# EAGLE design ups_main (EAGLE 9.6.2)
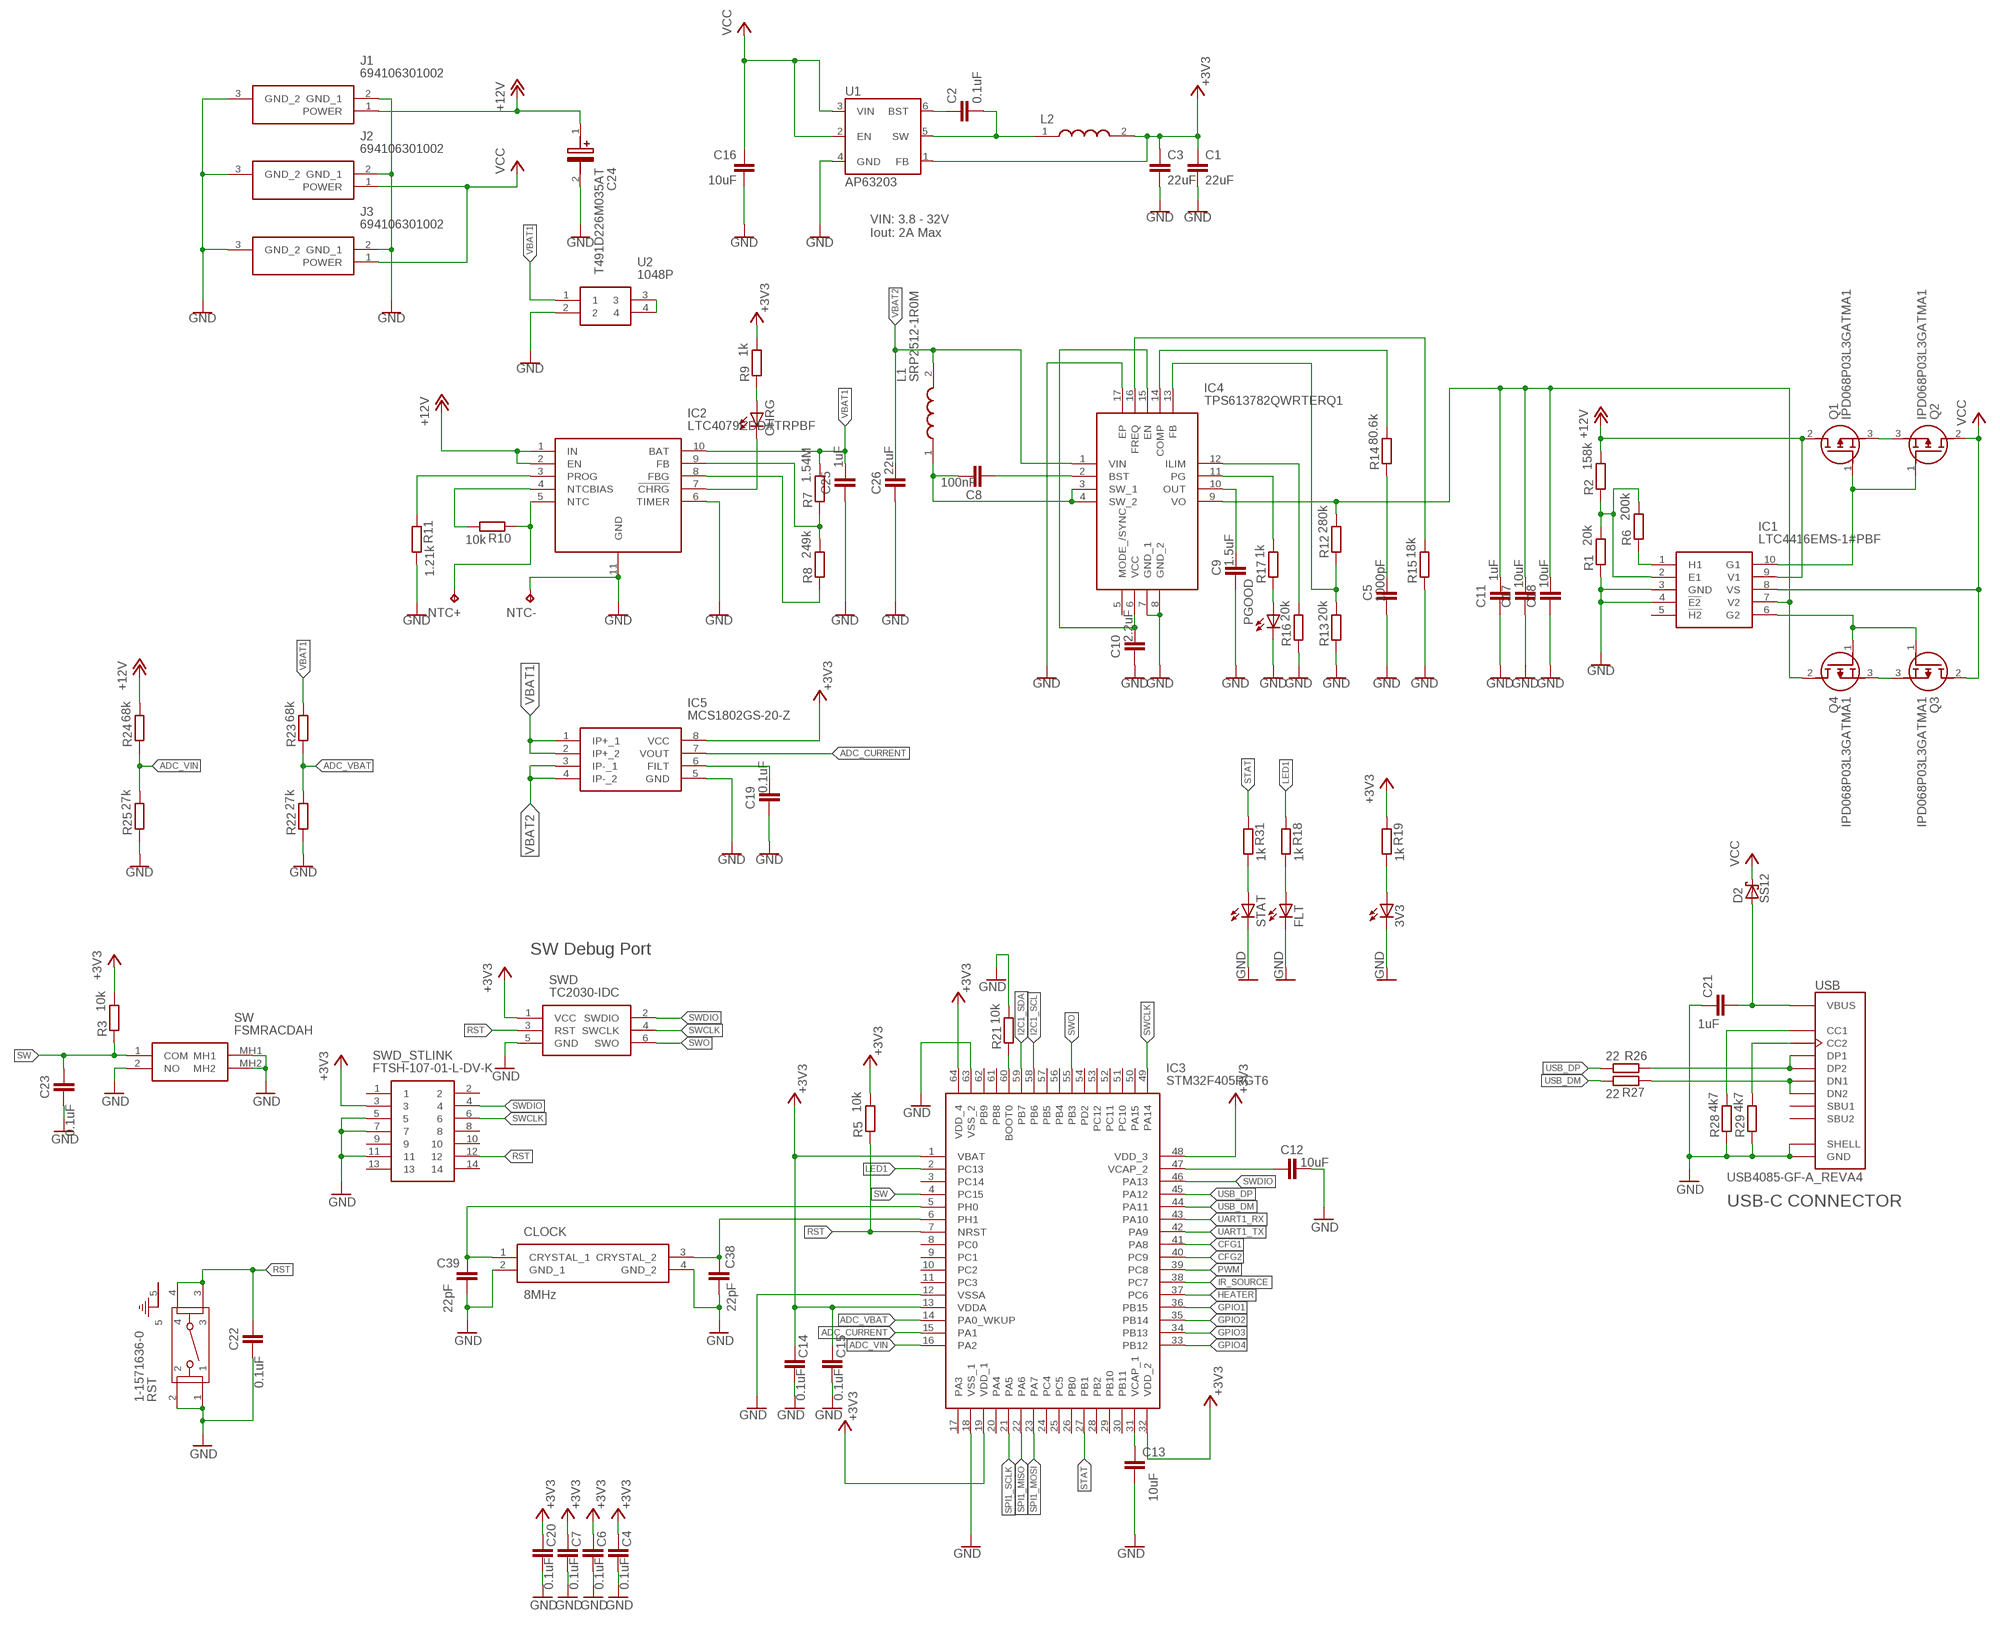
[diagram p0: schematic, sheet 1]

## Parts
3V3  LEDCHIPLED_0805  [CHIPLED_0805]
C1  22uF  22UF-0603-6.3V-20%  [0603]
C2  0.1uF  0.1UF-0603-25V-5%  [0603]
C3  22uF  22UF-0603-6.3V-20%  [0603]
C4  0.1uF  C-EUC0603K  [C0603K]
C5  1000pF  C-EUC0603K  [C0603K]
C6  0.1uF  C-EUC0603K  [C0603K]
C7  0.1uF  C-EUC0603K  [C0603K]
C8  100nF  C-EUC0603K  [C0603K]
C9  1.5uF  C-EUC0603K  [C0603K]
C10  2.2uF  C-EUC0603K  [C0603K]
C11  1uF  C-EUC0603K  [C0603K]
C12  10uF  C-EUC0603K  [C0603K]
C13  10uF  C-EUC0603K  [C0603K]
C14  0.1uF  C-EUC0603K  [C0603K]
C15  0.1uF  C-EUC0603K  [C0603K]
C16  10uF  10UF-1210-50V-20%  [1210]
C17  10uF  C-EUC0603K  [C0603K]
C18  10uF  C-EUC0603K  [C0603K]
C19  0.1uF  C-EUC0603K  [C0603K]
C20  0.1uF  C-EUC0603K  [C0603K]
C21  1uF  C-EUC0603K  [C0603K]
C22  0.1uF  C-EUC0603K  [C0603K]
C23  0.1uF  C-EUC0603K  [C0603K]
C24  T491D226M035AT  [T491D]
C25  1uF  C-EUC0603K  [C0603K]
C26  22uF  C-EUC0603K  [C0603K]
C38  22pF  C-EUC0603K  [C0603K]
C39  22pF  C-EUC0603K  [C0603K]
CHRG  LEDCHIPLED_0805  [CHIPLED_0805]
CLOCK  8MHz  ABM8AIG-8.000MHZ-1Z-T  [ABM8AIG8000MHZ1ZT]
D2  SS12  [DO214AC]
FLT  LEDCHIPLED_0805  [CHIPLED_0805]
IC1  LTC4416EMS-1#PBF  [SOP50P490X110-10N]
IC2  LTC4079EDD#TRPBF  [SON50P300X300X80-11N]
IC3  STM32F405RGT6  [QFP50P1200X1200X160-64N]
IC4  TPS613782QWRTERQ1  TPS613783QWRTERQ1  [QFN50P300X300X80-17N]
IC5  MCS1802GS-20-Z  [SOIC127P600X175-8N]
J1  694106301002  [694106301002_1]
J2  694106301002  [694106301002_1]
J3  694106301002  [694106301002_1]
L1  SRP2512-1R0M  [INDC2520X120N]
L2  MLZ2012M4R7HT000  [INDC2012X145N]
NTC+  TPPAD1-17  [P1-17]
NTC-  TPPAD1-17  [P1-17]
PGOOD  LEDCHIPLED_0805  [CHIPLED_0805]
Q1  IPD068P03L3GATMA1  [IPD068P03L3GATMA1]
Q2  IPD068P03L3GATMA1  [IPD068P03L3GATMA1]
Q3  IPD068P03L3GATMA1  [IPD068P03L3GATMA1]
Q4  IPD068P03L3GATMA1  [IPD068P03L3GATMA1]
R1  20k  R-EU_R0603  [R0603]
R2  158k  R-EU_R0603  [R0603]
R3  10k  R-EU_R0603  [R0603]
R5  10k  R-EU_R0603  [R0603]
R6  200k  R-EU_R0603  [R0603]
R7  1.54M  R-EU_R0603  [R0603]
R8  249k  R-EU_R0603  [R0603]
R9  1k  R-EU_R0603  [R0603]
R10  10k  R-EU_R0603  [R0603]
R11  1.21k  R-EU_R0603  [R0603]
R12  280k  R-EU_R0603  [R0603]
R13  20k  R-EU_R0603  [R0603]
R14  80.6k  R-EU_R0603  [R0603]
R15  18k  R-EU_R0603  [R0603]
R16  20k  R-EU_R0603  [R0603]
R17  1k  R-EU_R0603  [R0603]
R18  1k  R-EU_R0603  [R0603]
R19  1k  R-EU_R0603  [R0603]
R21  10k  R-EU_R0603  [R0603]
R22  27k  R-EU_R0603  [R0603]
R23  68k  R-EU_R0603  [R0603]
R24  68k  R-EU_R0603  [R0603]
R25  27k  R-EU_R0603  [R0603]
R26  22  R-EU_R0603  [R0603]
R27  22  R-EU_R0603  [R0603]
R28  4k7  R-EU_R0603  [R0603]
R29  4k7  R-EU_R0603  [R0603]
R31  1k  R-EU_R0603  [R0603]
RST  1-1571636-0  [SW5_1571636]
STAT  LEDCHIPLED_0805  [CHIPLED_0805]
SW  FSMRACDAH  [FSMRACDAH]
SWD  TC2030-IDC  [TC2030IDC]
SWD_STLINK  FTSH-107-01-L-DV-K  [FTSH-107-XX-YYY-DV-K]
U1  AP63203  [SOT23-6]
U2  1048P  [1048P]
USB  USB4085-GF-A_REVA4  [GCT_USB4085-GF-A_REVA4]

## Nets
+3V3: C1.1 C3.1 C4.1 C6.1 C7.1 C14.1 C15.1 C20.1 IC3.1(VBAT) IC3.13(VDDA) IC3.19(VDD_1) IC3.32(VDD_2) IC3.48(VDD_3) IC3.64(VDD_4) IC5.8(VCC) L2.2 R3.2 R5.2 R9.2 R19.1 SWD.1(VCC) SWD_STLINK.3 U1.1(FB)
+12V: C24.1(+) IC1.9(V1) IC2.1(IN) IC2.2(EN) J1.1(POWER) Q1.2(D) R2.2 R24.2
ADC_CURRENT: IC3.15(PA1) IC5.7(VOUT)
ADC_VBAT: IC3.14(PA0_WKUP) R22.2 R23.1
ADC_VIN: IC3.16(PA2) R24.1 R25.2
CFG1: IC3.41(PA8)
CFG2: IC3.40(PC9)
GND: 3V3.C C1.2 C3.2 C4.2 C5.1 C6.2 C7.2 C9.1 C10.1 C11.1 C12.2 C13.2 C14.2 C15.2 C16.2 C17.1 C18.1 C19.1 C20.2 C21.1 C22.2 C23.2 C24.2(-) C25.1 C26.1 C38.2 C39.2 CLOCK.2(GND_1) CLOCK.4(GND_2) FLT.C IC1.3(GND) IC1.4(!E2) IC2.6(TIMER) IC2.11(GND) IC3.12(VSSA) IC3.18(VSS_1) IC3.63(VSS_2) IC4.7(GND_1) IC4.8(GND_2) IC4.17(EP) IC5.5(GND) J1.2(GND_1) J1.3(GND_2) J2.2(GND_1) J2.3(GND_2) J3.2(GND_1) J3.3(GND_2) NTC-.TP PGOOD.C R1.1 R11.2 R13.1 R15.1 R16.1 R21.2 R22.1 R25.1 R28.1 R29.1 RST.1 RST.2 STAT.C SW.2(NO) SW.MH1 SW.MH2 SWD.5(GND) SWD_STLINK.5 SWD_STLINK.7 SWD_STLINK.11 U1.4(GND) U2.2 USB.A1(GND) USB.A12(GND) USB.B1(GND) USB.B12(GND) USB.P1(SHELL) USB.P2(SHELL) USB.P3(SHELL) USB.P4(SHELL)
GPIO1: IC3.36(PB15)
GPIO2: IC3.35(PB14)
GPIO3: IC3.34(PB13)
GPIO4: IC3.33(PB12)
HEATER: IC3.37(PC6)
I2C1_SCL: IC3.58(PB6)
I2C1_SDA: IC3.59(PB7)
IR_SOURCE: IC3.38(PC7)
LED1: IC3.2(PC13) R18.1
N$1: C2.1 U1.6(BST)
N$2: Q3.3(S) Q4.3(S)
N$3: IC1.6(G2) Q3.1(G) Q4.1(G)
N$4: FLT.A R18.2
N$5: IC1.10(G1) Q1.1(G) Q2.1(G)
N$6: C12.1 IC3.47(VCAP_2)
N$7: IC1.1(H1) R6.1
N$8: IC1.2(E1) R1.2 R2.1 R6.2
N$9: C2.2 L2.1 U1.5(SW)
N$10: Q1.3(S) Q2.3(S)
N$11: IC4.12(ILIM) R16.2
N$12: C13.1 IC3.31(VCAP_1)
N$13: IC4.11(PG) R17.2
N$14: IC2.4(NTCBIAS) R10.2
N$15: IC2.5(NTC) NTC+.TP R10.1
N$16: IC2.3(PROG) R11.1
N$17: IC2.9(FB) R7.1 R8.2
N$18: IC2.8(FBG) R8.1
N$19: CHRG.C IC2.7(!CHRG)
N$20: C38.1 CLOCK.3(CRYSTAL_2) IC3.6(PH1)
N$21: C9.2 IC4.10(OUT)
N$22: IC4.16(FREQ) R15.2
N$23: IC4.14(COMP) R14.2
N$24: C8.1 IC4.2(BST)
N$25: C8.2 IC4.3(SW_1) IC4.4(SW_2) L1.1
N$26: C39.1 CLOCK.1(CRYSTAL_1) IC3.5(PH0)
N$27: C5.2 R14.1
N$28: IC4.13(FB) R12.1 R13.2
N$30: 3V3.A R19.2
N$31: R31.2 STAT.A
N$32: C21.2 D2.A USB.A4(VBUS) USB.A9(VBUS) USB.B4(VBUS) USB.B9(VBUS)
N$33: PGOOD.A R17.1
N$34: CHRG.A R9.1
N$35: IC3.60(BOOT0) R21.1
N$36: R26.1 USB.A6(DP1) USB.B6(DP2)
N$37: C10.2 IC4.6(VCC) IC4.15(EN)
N$38: R27.1 USB.A7(DN1) USB.B7(DN2)
N$40: C19.2 IC5.6(FILT)
N$41: U2.3 U2.4
N$46: R29.2 USB.B5(CC2)
N$47: R28.2 USB.A5(CC1)
PWM: IC3.39(PC8)
RST: C22.1 IC3.7(NRST) R5.1 RST.3 RST.4 SWD.3(RST) SWD_STLINK.12
SPI1_MISO: IC3.22(PA6)
SPI1_MOSI: IC3.23(PA7)
SPI1_SCLK: IC3.21(PA5)
STAT: IC3.27(PB1) R31.1
SW: C23.1 IC3.4(PC15) R3.1 SW.1(COM)
SWCLK: IC3.49(PA14) SWD.4(SWCLK) SWD_STLINK.6
SWDIO: IC3.46(PA13) SWD.2(SWDIO) SWD_STLINK.4
SWO: IC3.55(PB3) SWD.6(SWO)
UART1_RX: IC3.43(PA10)
UART1_TX: IC3.42(PA9)
USB_DM: IC3.44(PA11) R27.2
USB_DP: IC3.45(PA12) R26.2
VBAT1: C25.2 IC2.10(BAT) IC5.1(IP+_1) IC5.2(IP+_2) R7.2 R23.2 U2.1
VBAT2: C26.2 IC4.1(VIN) IC5.3(IP-_1) IC5.4(IP-_2) L1.2
VCC: C16.1 D2.C IC1.8(VS) J2.1(POWER) J3.1(POWER) Q2.2(D) Q3.2(D) U1.2(EN) U1.3(VIN)
VO: C11.2 C17.2 C18.2 IC1.7(V2) IC4.9(VO) Q4.2(D) R12.2
Unconnected: IC1.5(!H2) IC3.3(PC14) IC3.8(PC0) IC3.9(PC1) IC3.10(PC2) IC3.11(PC3) IC3.17(PA3) IC3.20(PA4) IC3.24(PC4) IC3.25(PC5) IC3.26(PB0) IC3.28(PB2) IC3.29(PB10) IC3.30(PB11) IC3.50(PA15) IC3.51(PC10) IC3.52(PC11) IC3.53(PC12) IC3.54(PD2) IC3.56(PB4) IC3.57(PB5) IC3.61(PB8) IC3.62(PB9) IC4.5(MODE_/SYNC) RST.5 SWD_STLINK.1 SWD_STLINK.2 SWD_STLINK.8 SWD_STLINK.9 SWD_STLINK.10 SWD_STLINK.13 SWD_STLINK.14 USB.A8(SBU1) USB.B8(SBU2)

## Notes on the sheet
- VIN: 3.8 - 32V
  Iout: 2A Max
- SW Debug Port
- USB-C CONNECTOR

## Library data of the parts
3V3 CHRG FLT PGOOD STAT = led:LED: LED OSRAM: - CHIPLED LG R971, LG N971, LY N971, LG Q971, LY Q971, LO R971, LY R971 LH N974, LH R974 LS Q976, LO Q976, LY Q976 LO Q996 - Hyper CHIPLED LW Q18S LB Q993, LB Q99A, LB R99A - SideLED LS A670, LO A670, LY A670, LG A670, LP A670 LB A673, LV A673, LT A673, LW A673 LH A674 LY A675 LS A676, LA A676, LO A676, LY A676, LW A676 LS A679, LY A679, LG A679 - Hyper Micro SIDELED® LS Y876, LA Y876, LO Y876, LY Y876 LT Y87S - SmartLED LW L88C, LW L88S LB L89C, LB L89S, LG L890 LS L89K, LO L89K, LY L89K LS L896, LA L896, LO L896, LY L896 - TOPLED LS T670, LO T670, LY T670, LG T670, LP T670 LSG T670, LSP T670, LSY T670, LOP T670, LYG T670 LG T671, LOG T671, LSG T671 LB T673, LV T673, LT T673, LW T673 LH T674 LS T676, LA T676, LO T676, LY T676, LB T676, LH T676, LSB T676, LW T676 LB T67C, LV T67C, LT T67C, LS T67K, LO T67K, LY T67K, LW E67C LS E67B, LA E67B, LO E67B, LY E67B, LB E67C, LV E67C, LT E67C LW T67C LS T679, LY T679, LG T679 LS T770, LO T770, LY T770, LG T770, LP T770 LB T773, LV T773, LT T773, LW T773 LH T774 LS E675, LA E675, LY E675, LS T675 LS T776, LA T776, LO T776, LY T776, LB T776 LHGB T686 LT T68C, LB T68C - Hyper Mini TOPLED® LB M676 - Mini TOPLED Santana® LG M470 LS M47K, LO M47K, LY M47K Source: http://www.osram.convergy.de LUXEON: - LUMILED® LXK2-PW12-R00, LXK2-PW12-S00, LXK2-PW14-U00, LXK2-PW14-V00 LXK2-PM12-R00, LXK2-PM12-S00, LXK2-PM14-U00 LXK2-PE12-Q00, LXK2-PE12-R00, LXK2-PE12-S00, LXK2-PE14-T00, LXK2-PE14-U00 LXK2-PB12-K00, LXK2-PB12-L00, LXK2-PB12-M00, LXK2-PB14-N00, LXK2-PB14-P00, LXK2-PB14-Q00 LXK2-PR12-L00, LXK2-PR12-M00, LXK2-PR14-Q00, LXK2-PR14-R00 LXK2-PD12-Q00, LXK2-PD12-R00, LXK2-PD12-S00 LXK2-PH12-R00, LXK2-PH12-S00 LXK2-PL12-P00, LXK2-PL12-Q00, LXK2-PL12-R00 Source: www.luxeon.com KINGBRIGHT: KA-3528ASYC Source: www.kingbright.com
C1 C3 = SparkFun-Capacitors:22UF: 22µF ceramic capacitors A capacitor is a passive two-terminal electrical component used to store electrical energy temporarily in an electric field.; PROD_ID: CAP-14464
C2 = SparkFun-Capacitors:0.1UF: 0.1µF ceramic capacitors A capacitor is a passive two-terminal electrical component used to store electrical energy temporarily in an electric field.; PROD_ID: CAP-08604
C4-C15 C17-C23 C25 C26 C38 C39 = rcl:C-EU: CAPACITOR, European symbol; SPICEPREFIX: C
C16 = SparkFun-Capacitors:10UF: 10.0µF ceramic capacitors A capacitor is a passive two-terminal electrical component used to store electrical energy temporarily in an electric field.; PROD_ID: CAP-09824
C24 = T491D226M035AT:T491D226M035AT: T491, Tantalum, MnO2 Tantalum, Commercial Grade, 22 uF, 20%, 35 VDC, 125C, -55C, 85C, SMD, MnO2, Molded, 6 % , 700 mOhms, 7700 nA, 446.84 mg, 7343, 2.8mm, Height Max = 3.1mm, 500, 156 Weeks Source: Datasheet <https://content.kemet.com/datasheets/KEM_T2005_T491.pdf>; DESCRIPTION: T491, Tantalum, MnO2 Tantalum, Commercial Grade, 22 uF, 20%, 35 VDC, 125C, -55C, 85C, SMD, MnO2, Molded, 6 % , 700 mOhms, 7700 nA, 446.84 mg, 7343, 2.8mm, Height Max = 3.1mm, 500, 156 Weeks; HEIGHT: 3.1mm; MANUFACTURER_NAME: KEMET; MANUFACTURER_PART_NUMBER: T491D226M035AT; MOUSER_PART_NUMBER: 80-T491D226M035; MOUSER_PRICE-STOCK: https://www.mouser.co.uk/ProductDetail/KEMET/T491D226M035AT?qs=2Dzs5xnho3a9L55s8fyD1A%3D%3D
CLOCK = ABM8AIG-8.000MHZ-1Z-T:ABM8AIG-8.000MHZ-1Z-T: Crystals 18pF 8MHz 10ppm AEC-Q200 -40C +125C Source: Datasheet <https://abracon.com/AIGcrystals/ABM8AIG.pdf>; DESCRIPTION: Crystals 18pF 8MHz 10ppm AEC-Q200 -40C +125C; HEIGHT: 0.8mm; MANUFACTURER_NAME: ABRACON; MANUFACTURER_PART_NUMBER: ABM8AIG-8.000MHZ-1Z-T; MOUSER_PART_NUMBER: 815-M8AIG-8-1ZT; MOUSER_PRICE-STOCK: https://www.mouser.com/Search/Refine.aspx?Keyword=815-M8AIG-8-1ZT
D2 = SS12:SS12: http://octopart.com/ss12-tp-mcc-9293796; AVAILABILITY: Unavailable; DESCRIPTION: SS12 Series 500 mV 1 A 20 V Max Reverse Voltage Schottky Rectifier - DO-214AC; MF: Klein Tools,; MP: SS12; PACKAGE: DO-214AC-214 ON Semiconductor; PRICE: None
IC1 = LTC4416EMS-1#PBF:LTC4416EMS-1#PBF: Linear Technology LTC4416EMS-1#PBF, MOSFET Controller 10-Pin, MSOP Source: Datasheet <https://www.analog.com/media/en/technical-documentation/data-sheets/4416fa.pdf>; DESCRIPTION: Linear Technology LTC4416EMS-1#PBF, MOSFET Controller 10-Pin, MSOP; HEIGHT: 1.1mm; MANUFACTURER_NAME: Analog Devices; MANUFACTURER_PART_NUMBER: LTC4416EMS-1#PBF; MOUSER_PART_NUMBER: 584-LTC4416EMS-1#PBF; MOUSER_PRICE-STOCK: https://www.mouser.co.uk/ProductDetail/Analog-Devices/LTC4416EMS-1PBF?qs=hVkxg5c3xu9mDay6QbsUoQ%3D%3D
IC2 = LTC4079EDD#TRPBF:LTC4079EDD#TRPBF: Battery Management Low Iq 60V, 250mA Linear Charger Source: Datasheet <http://www.linear.com/docs/45554>; DESCRIPTION: Battery Management Low Iq 60V, 250mA Linear Charger; HEIGHT: 0.8mm; MANUFACTURER_NAME: Analog Devices; MANUFACTURER_PART_NUMBER: LTC4079EDD#TRPBF; MOUSER_PART_NUMBER: 584-LTC4079EDD#TRPBF; MOUSER_PRICE-STOCK: https://www.mouser.co.uk/ProductDetail/Analog-Devices/LTC4079EDDTRPBF?qs=hVkxg5c3xu9bytIIUSwPNA%3D%3D
IC3 = STM32F405RGT6:STM32F405RGT6: MCU 32-Bit, ARM Cortex M4, 1MB Flash STMicroelectronics STM32F405RGT6, 32bit ARM Cortex M4F Microcontroller, 168MHz, 1024 kB Flash, 64-Pin LQFP Source: Datasheet <http://www.st.com/web/en/resource/technical/document/datasheet/DM00037051.pdf>; DESCRIPTION: MCU 32-Bit, ARM Cortex M4, 1MB Flash STMicroelectronics STM32F405RGT6, 32bit ARM Cortex M4F Microcontroller, 168MHz, 1024 kB Flash, 64-Pin LQFP; HEIGHT: 1.6mm; MANUFACTURER_NAME: STMicroelectronics; MANUFACTURER_PART_NUMBER: STM32F405RGT6; MOUSER_PART_NUMBER: 511-STM32F405RGT6; MOUSER_PRICE-STOCK: https://www.mouser.co.uk/ProductDetail/STMicroelectronics/STM32F405RGT6?qs=Z8%252BeY1k3TIKgj7QWsYGpQw%3D%3D
IC4 = TPS613783QWRTERQ1:TPS613783QWRTERQ1: Switching Voltage Regulators 18.5-V output, 4.8-A synchronous boost converter with load disconnect 16-WQFN -40 to 125 Source: Datasheet <https://www.ti.com/lit/ds/symlink/tps61378-q1.pdf?ts=1623306788513&ref_url=https%3A%2F%2Fwww.ti.com%2Fstore%2Fti%2Fen%2Fp%2Fproduct%2F%3Fp%3DTPS613785QWRTERQ1>; DESCRIPTION: Switching Voltage Regulators 18.5-V output, 4.8-A synchronous boost converter with load disconnect 16-WQFN -40 to 125; HEIGHT: 0.8mm; MANUFACTURER_NAME: Texas Instruments; MANUFACTURER_PART_NUMBER: TPS613783QWRTERQ1; MOUSER_PART_NUMBER: 595-PS613783QWRTERQ1; MOUSER_PRICE-STOCK: https://www.mouser.co.uk/ProductDetail/Texas-Instruments/TPS613783QWRTERQ1?qs=DRkmTr78QAS2n8buuGBazA%3D%3D
IC5 = MCS1802GS-20-Z:MCS1802GS-20-Z: Board Mount Current Sensors 3.3V Hall current sensor. 1.5% accuracy. 2.4kV Isolation Source: Datasheet <https://www.monolithicpower.com/en/documentview/productdocument/index/version/2/document_type/Datasheet/lang/en/sku/MCS1802/document_id/5066/>; DESCRIPTION: Board Mount Current Sensors 3.3V Hall current sensor. 1.5% accuracy. 2.4kV Isolation; HEIGHT: 1.75mm; MANUFACTURER_NAME: Monolithic Power Systems (MPS); MANUFACTURER_PART_NUMBER: MCS1802GS-20-Z; MOUSER_PART_NUMBER: 946-MCS1802GS-20-Z; MOUSER_PRICE-STOCK: https://www.mouser.co.uk/ProductDetail/Monolithic-Power-Systems-MPS/MCS1802GS-20-Z?qs=GedFDFLaBXEbUAyCuVB7cw%3D%3D
J1-J3 = 694106301002:694106301002: WURTH ELEKTRONIK - 694106301002 - CONNECTOR, POWER ENTRY, JACK, 3A, 20VDC Source: Datasheet <https://datasheet.datasheetarchive.com/originals/distributors/Datasheets_SAMA/1c153bd2ba42bb51bda59ee4cd9765cd.pdf>; DESCRIPTION: WURTH ELEKTRONIK - 694106301002 - CONNECTOR, POWER ENTRY, JACK, 3A, 20VDC; HEIGHT: mm; MANUFACTURER_NAME: Wurth Elektronik; MANUFACTURER_PART_NUMBER: 694106301002; MOUSER_PART_NUMBER: 710-694106301002; MOUSER_PRICE-STOCK: https://www.mouser.co.uk/ProductDetail/Wurth-Elektronik/694106301002?qs=a9WhcLg8qCwOEkcI62k5mA%3D%3D
L1 = SRP2512-1R0M:SRP2512-1R0M: BOURNS - SRP2512-1R0M - INDUCTOR, WIREWOUND, 1UH, 20%, 3.1A Source: Datasheet <https://componentsearchengine.com/Datasheets/2/SRP2512-1R0M.pdf>; DESCRIPTION: BOURNS - SRP2512-1R0M - INDUCTOR, WIREWOUND, 1UH, 20%, 3.1A; HEIGHT: 1.2mm; MANUFACTURER_NAME: Bourns; MANUFACTURER_PART_NUMBER: SRP2512-1R0M; MOUSER_PART_NUMBER: 652-SRP2512-1R0M; MOUSER_PRICE-STOCK: https://www.mouser.co.uk/ProductDetail/Bourns/SRP2512-1R0M?qs=fHAk5VQYflc1VrtfzBcSKQ%3D%3D
L2 = MLZ2012M4R7HT000:MLZ2012M4R7HT000: Inductor Power Shielded Multi-Layer 4.7uH 20% 2MHz Ferrite 0.4A 0.442Ohm DCR 0805 T/R Source: Datasheet <https://product.tdk.com/system/files/dam/doc/product/inductor/inductor/smd/catalog/inductor_commercial_decoupling_mlz2012_en.pdf>; DESCRIPTION: Inductor Power Shielded Multi-Layer 4.7uH 20% 2MHz Ferrite 0.4A 0.442Ohm DCR 0805 T/R; HEIGHT: 1.45mm; MANUFACTURER_NAME: TDK-Lambda; MANUFACTURER_PART_NUMBER: MLZ2012M4R7HT000; MOUSER_PART_NUMBER: 810-MLZ2012M4R7HT000; MOUSER_PRICE-STOCK: https://www.mouser.co.uk/ProductDetail/TDK/MLZ2012M4R7HT000?qs=%2FPzWLGNeQ%252BgQgMrI9kQ17A%3D%3D
NTC+ NTC- = testpad:TP: Test pad
Q1-Q4 = IPD068P03L3GATMA1:IPD068P03L3GATMA1: MOSFET TRENCH <= 40V Source: Datasheet <https://componentsearchengine.com/Datasheets/1/IPD068P03L3GATMA1.pdf>; DESCRIPTION: MOSFET TRENCH <= 40V; HEIGHT: 2.41mm; MANUFACTURER_NAME: Infineon; MANUFACTURER_PART_NUMBER: IPD068P03L3GATMA1; MOUSER_PART_NUMBER: 726-IPD068P03L3GATMA; MOUSER_PRICE-STOCK: https://www.mouser.co.uk/ProductDetail/Infineon-Technologies/IPD068P03L3GATMA1?qs=RJIhqtkBntMB6UQHOyDZmg%3D%3D
R1-R3 R5-R19 R21-R29 R31 = rcl:R-EU_: RESISTOR, European symbol; SPICEPREFIX: R
RST = TACTILE:1-1571636-0; BUILT_BY: EMA_UL_Team; CONFIGURATION__POLE-THROW_: Single Pole - Single Throw; COPYRIGHT: Copyright (C) 2016 Accelerated Designs. All rights reserved; DESCRIPTION: TACT,SMT,GULL WING,260GF,T&R; MANUFACTURER_PART_NUMBER: 1-1571636-0; MAX_SWITCHING_CURRENT: -; MAX_SWITCHING_VOLTAGE_AC_: -; PRODUCT_TYPE: Switch; SWITCH_TYPE: Tactile Switches; TE_PART_NUMBER: 1-1571636-0; VENDOR: TE Connectivity
SW = FSMRACDAH:FSMRACDAH: TE CONNECTIVITY / ALCOSWITCH - FSMRACDAH - TACTILE SWITCH, SPST-NO, 0.05A, 24V, TH Source: Datasheet <https://www.te.com/commerce/DocumentDelivery/DDEController?Action=showdoc&DocId=Customer Drawing1825968B1pdfEnglishENG_CD_1825968_B1.pdf1825968-2>; DESCRIPTION: TE CONNECTIVITY / ALCOSWITCH - FSMRACDAH - TACTILE SWITCH, SPST-NO, 0.05A, 24V, TH; HEIGHT: 9.2mm; MANUFACTURER_NAME: TE Connectivity; MANUFACTURER_PART_NUMBER: FSMRACDAH; MOUSER_PART_NUMBER: 506-FSMRACDAH; MOUSER_PRICE-STOCK: https://www.mouser.co.uk/ProductDetail/TE-Connectivity-Alcoswitch/FSMRACDAH?qs=GXuM9q1TrDlqFSLkwG2zzQ%3D%3D
SWD = TC2030-IDC:TC2030-IDC: CABLE ADAPTER 6 POS Source: Datasheet <http://www.tag-connect.com/Materials/TC2030-IDC.pdf>; DESCRIPTION: CABLE ADAPTER 6 POS; HEIGHT: 19mm; MANUFACTURER_NAME: Tag Connect; MANUFACTURER_PART_NUMBER: TC2030-IDC
SWD_STLINK = FTSH-107-01-L-DV-K:FTSH-107-01-L-DV-K: 14 Position, High Reliability Header Strips, 0.050" pitch Source: Datasheet <http://suddendocs.samtec.com/prints/ftsh-1xx-xx-xxx-dv-xxx-xxx-mkt.pdf>; ARROW_PART_NUMBER: FTSH-107-01-L-DV-K; ARROW_PRICE-STOCK: https://www.arrow.com/en/products/ftsh-107-01-l-dv-k/samtec; DESCRIPTION: 14 Position, High Reliability Header Strips, 0.050&quot; pitch; HEIGHT: mm; MANUFACTURER_NAME: SAMTEC; MANUFACTURER_PART_NUMBER: FTSH-107-01-L-DV-K; MOUSER_PART_NUMBER: 200-FTSH10701LDVK; MOUSER_PRICE-STOCK: https://www.mouser.co.uk/ProductDetail/Samtec/FTSH-107-01-L-DV-K?qs=%252BZP6%2F%252BtExtBNGLAeWROTVA%3D%3D
U1 = SparkFun-IC-Power:AP63203: Diodes Inc. AP63203 3.8V-32V input 3.3V Buck The AP63200/AP63201/AP63203/AP63205 is a 2A, synchronous buck converter with a wide input voltage range of 3.8V to 32V and fully integrates a 125mΩ high-side power MOSFET and a 68mΩ lowside power MOSFET to provide high-efficiency step-down DC/DC conversion; PROD_ID: VREG-15244
U2 = 1048P:1048P: KEYSTONE - 1048P - BATTERY HOLDER, 18650, SMD Source: Datasheet <http://www.keyelco.com/product-pdf.cfm?p=13959>; DESCRIPTION: KEYSTONE - 1048P - BATTERY HOLDER, 18650, SMD; HEIGHT: mm; MANUFACTURER_NAME: Keystone Electronics; MANUFACTURER_PART_NUMBER: 1048P; MOUSER_PART_NUMBER: 534-1048P; MOUSER_PRICE-STOCK: https://www.mouser.co.uk/ProductDetail/Keystone-Electronics/1048P?qs=9%252Bwcgl%2FJqd1h8Vx3IFpTxA%3D%3D
USB = USB4085-GF-A_REVA4:USB4085-GF-A_REVA4: USB 2.0 Type C Receptacle Dip Type, PCB Top Mount Check prices <https://pricing.snapeda.com/parts/USB4085-GF-A/Global%20Connector%20Technology/view-part?ref=eda>; AVAILABILITY: In Stock; DESCRIPTION: USB-C (USB TYPE-C) USB 2.0 Receptacle Connector 24 (16+8 Dummy) Position Through Hole, Right Angle, low cost, 3.46mm profile, 16 pin, horizontal, Top mount; MF: Global Connector Technology; MP: USB4085-GF-A; PACKAGE: None; PRICE: None; PURCHASE-URL: https://pricing.snapeda.com/search/part/USB4085-GF-A/?ref=eda

## Board
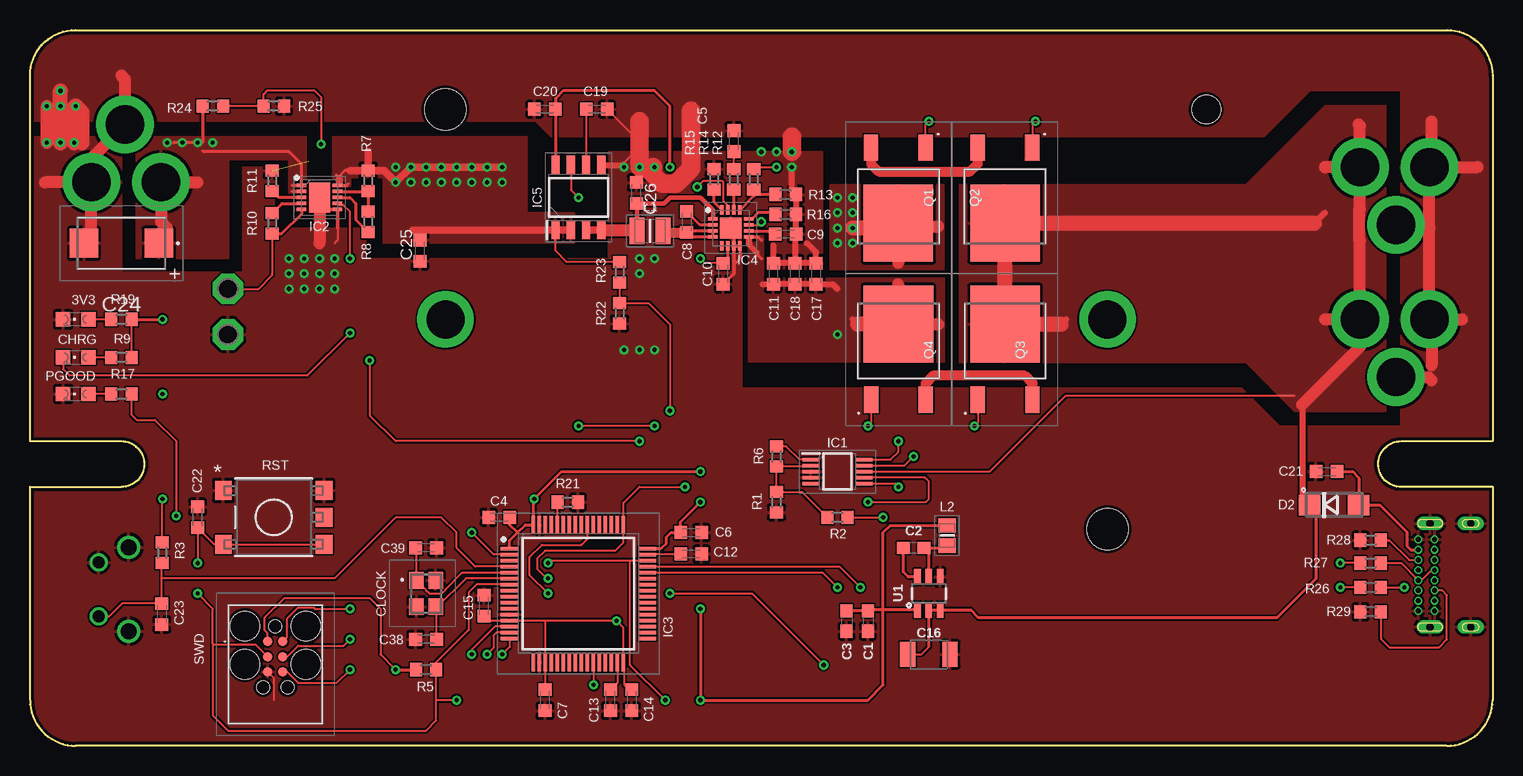
[diagram p1: board, top side]
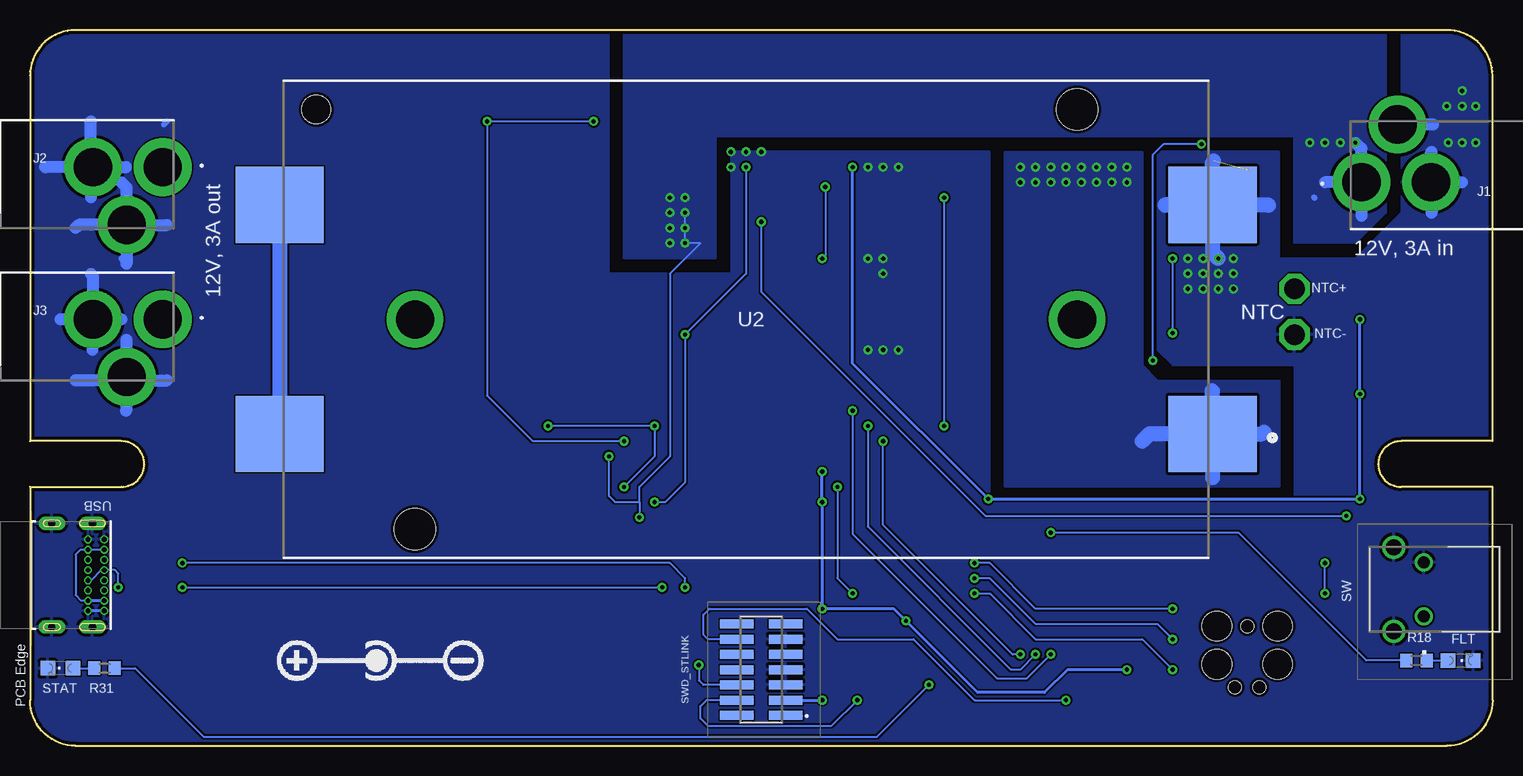
[diagram p2: board, bottom side, seen from below]

Size 121.92 x 59.69 mm. Coordinates in mm from the lower left corner, seen from the top.
Outline: 0,3.81 0,21.59 7.62,21.59 arc180 7.62,25.4 0,25.4 0,55.88 arc-90 3.81,59.69 118.11,59.69 arc-90 121.92,55.88 121.92,25.4 114.3,25.4 arc180 114.3,21.59 121.92,21.59 121.92,3.81 arc-90 118.11,0 3.81,0 arc-90 0,3.81
Copper layers (1*16): Top 0.035mm / dielectric 1.5mm / Bottom 0.035mm
Design rules "default *": minimum track width 6mil, minimum drill 0.35mm, track to track 6mil, track to pad 6mil, pad to pad 6mil, via to via 8mil, smd to smd 6mil, copper to edge 10mil, drill to drill 6mil, minimum pad ring 5mil, minimum via ring 8mil, stop-mask expansion 4mil, vias tented up to drill 0mil, thermal gap 10mil

### Footprints (pad centres in the part's own frame; a part is rotated, then mirrored left to right if it is on the bottom)
CHIPLED_0805 = smd 1.2 x 1.2: A 0,-1.05; C 0,1.05
0603 = smd 1.1 x 1: 1 -0.85,0; 2 0.85,0
C0603K = smd 1.05 x 1.08: 1 -0.875,0; 2 0.875,0
1210 = smd 1.27 x 2.06: 1 -1.755,0; 2 1.755,0
T491D = smd 2.37 x 2.43: 1 -3.12,0; 2 3.12,0
ABM8AIG8000MHZ1ZT = smd 1.4 x 1.2: 1 -1.1,-0.8; 2 1.1,-0.8; 3 1.1,0.8; 4 -1.1,0.8
DO214AC = smd 1.8 x 1.7: A 2.05,0; C -2.05,0
SOP50P490X110-10N = smd 1.425 x 0.3: 1 -2.212,1; 2 -2.212,0.5; 3 -2.212,0; 4 -2.212,-0.5; 5 -2.212,-1; 6 2.212,-1; 7 2.212,-0.5; 8 2.212,0; 9 2.212,0.5; 10 2.212,1
SON50P300X300X80-11N = smd 0.8 x 0.3: 1 -1.5,1; 2 -1.5,0.5; 3 -1.5,0; 4 -1.5,-0.5; 5 -1.5,-1; 6 1.5,-1; 7 1.5,-0.5; 8 1.5,0; 9 1.5,0.5; 10 1.5,1 | smd 1.75 x 2.48: 11 0,0
QFP50P1200X1200X160-64N = smd 1.475 x 0.3: 1 -5.738,3.75; 2 -5.738,3.25; 3 -5.738,2.75; 4 -5.738,2.25; 5 -5.738,1.75; 6 -5.738,1.25; 7 -5.738,0.75; 8 -5.738,0.25; 9 -5.738,-0.25; 10 -5.738,-0.75; 11 -5.738,-1.25; 12 -5.738,-1.75; 13 -5.738,-2.25; 14 -5.738,-2.75; 15 -5.738,-3.25; 16 -5.738,-3.75; 33 5.738,-3.75; 34 5.738,-3.25; 35 5.738,-2.75; 36 5.738,-2.25; 37 5.738,-1.75; 38 5.738,-1.25; 39 5.738,-0.75; 40 5.738,-0.25; 41 5.738,0.25; 42 5.738,0.75; 43 5.738,1.25; 44 5.738,1.75; 45 5.738,2.25; 46 5.738,2.75; 47 5.738,3.25; 48 5.738,3.75 | smd 0.3 x 1.475: 17 -3.75,-5.738; 18 -3.25,-5.738; 19 -2.75,-5.738; 20 -2.25,-5.738; 21 -1.75,-5.738; 22 -1.25,-5.738; 23 -0.75,-5.738; 24 -0.25,-5.738; 25 0.25,-5.738; 26 0.75,-5.738; 27 1.25,-5.738; 28 1.75,-5.738; 29 2.25,-5.738; 30 2.75,-5.738; 31 3.25,-5.738; 32 3.75,-5.738; 49 3.75,5.738; 50 3.25,5.738; 51 2.75,5.738; 52 2.25,5.738; 53 1.75,5.738; 54 1.25,5.738; 55 0.75,5.738; 56 0.25,5.738; 57 -0.25,5.738; 58 -0.75,5.738; 59 -1.25,5.738; 60 -1.75,5.738; 61 -2.25,5.738; 62 -2.75,5.738; 63 -3.25,5.738; 64 -3.75,5.738
QFN50P300X300X80-17N = smd 0.8 x 0.3: 1 -1.5,0.75; 2 -1.5,0.25; 3 -1.5,-0.25; 4 -1.5,-0.75; 9 1.5,-0.75; 10 1.5,-0.25; 11 1.5,0.25; 12 1.5,0.75 | smd 0.3 x 0.8: 5 -0.75,-1.5; 6 -0.25,-1.5; 7 0.25,-1.5; 8 0.75,-1.5; 13 0.75,1.5; 14 0.25,1.5; 15 -0.25,1.5; 16 -0.75,1.5 | smd 1.76 x 1.76: 17 0,0
SOIC127P600X175-8N = smd 1.525 x 0.7: 1 -2.712,1.905; 2 -2.712,0.635; 3 -2.712,-0.635; 4 -2.712,-1.905; 5 2.712,-1.905; 6 2.712,-0.635; 7 2.712,0.635; 8 2.712,1.905
694106301002_1 = drill 3.2 pad 4.8: 1 13.6,3.8; 2 7.8,3.8; 3 10.6,-1
INDC2520X120N = smd 1.25 x 2.2: 1 -1.1,0; 2 1.1,0
INDC2012X145N = smd 1.2 x 1.45: 1 -0.85,0; 2 0.85,0
P1-17 = drill 1.702 pad 2.54 octagon: TP 0,0
IPD068P03L3GATMA1 = smd 2.2 x 1.2: 1 4.16,-2.275; 3 4.16,2.285 | smd 6.4 x 5.8: 2 -2.14,0.005
R0603 = smd 1 x 1.1: 1 -0.85,0; 2 0.85,0
SW5_1571636 = smd 1.397 x 1.6: 1 -4.204,2.248; 2 4.204,2.248; 3 -4.204,-2.248; 4 4.204,-2.248; 5 4.204,0
FSMRACDAH = drill 1 pad 1.5: 1 0,0.04; 2 4.5,0.04 | drill 1.3 pad 1.95: MH1 -1.25,2.54; MH2 5.75,2.54
TC2030IDC = smd 0.783 x 0.783: 1 -0.953,-0.635; 2 -0.953,0.635; 3 0.317,-0.635; 4 0.317,0.635; 5 1.588,-0.635; 6 1.588,0.635 | hole 2.451: -2.223,-2.54; -2.223,2.54; 0.952,-2.54; 0.952,2.54 | hole 1.067: -2.223,0; 2.857,-1.016; 2.857,1.016
FTSH-107-XX-YYY-DV-K = smd 0.74 x 2.79: 1 -3.81,-2.035; 2 -3.81,2.035; 3 -2.54,-2.035; 4 -2.54,2.035; 5 -1.27,-2.035; 6 -1.27,2.035; 7 0,-2.035; 8 0,2.035; 9 1.27,-2.035; 10 1.27,2.035; 11 2.54,-2.035; 12 2.54,2.035; 13 3.81,-2.035; 14 3.81,2.035
SOT23-6 = smd 0.55 x 1.35: 1 -0.95,-1.375; 2 0,-1.375; 3 0.95,-1.375; 4 0.95,1.375; 5 0,1.375; 6 -0.95,1.375
1048P = smd 7.34 x 6.35: 1 -38.89,9.555; 2 -38.89,-9.555; 3 38.89,-9.555; 4 38.89,9.555 | drill 3.17 pad 4.7: 6 27.6,0; 7 -27.6,0 | hole 3.45: 27.6,17.505; -27.6,-17.505 | hole 2.39: 35.82,-17.505
GCT_USB4085-GF-A_REVA4 = drill 0.4 pad 0.65: A1 -2.975,4.025; A4 -2.125,4.025; A5 -1.275,4.025; A6 -0.425,4.025; A7 0.425,4.025; A8 1.275,4.025; A9 2.125,4.025; A12 2.975,4.025; B1 2.975,2.675; B4 2.125,2.675; B5 1.275,2.675; B6 0.425,2.675; B7 -0.425,2.675; B8 -1.275,2.675; B9 -2.125,2.675; B12 -2.975,2.675 | drill 0.6 pad 1.108 long: P1 -4.325,3.045; P2 4.325,3.045; P3 4.325,-0.335; P4 -4.325,-0.335

### Placement (x,y rotation side)
3V3  3.81,35.56 90 top
C1  69.85,10.41 270 top
C2  73.66,16.51 0 top
C3  68.07,10.41 270 top
C4  39.12,19.05 180 top
C5  58.67,50.42 270 top
C6  55.12,17.78 0 top
C7  42.93,3.81 270 top
C8  54.74,43.69 270 top
C9  62.99,42.67 180 top
C10  57.79,39.37 90 top
C11  61.98,39.37 270 top
C12  55.12,16 0 top
C13  48.39,3.81 270 top
C14  50.17,3.81 270 top
C15  37.85,11.68 90 top
C16  74.93,7.62 0 top
C17  65.53,39.37 270 top
C18  63.75,39.37 270 top
C19  47.24,53.09 180 top
C20  42.93,53.09 180 top
C21  108.08,22.86 0 top
C22  13.97,19.05 90 top
C23  11,11 270 top
C24  7.62,41.91 180 top
C25  32.51,41.27 90 top
C26  50.55,46.1 270 top
C38  33.02,8.89 180 top
C39  33.02,16.51 0 top
CHRG  3.81,32.38 90 top
CLOCK  33.02,12.7 270 top
D2  108.71,20.07 0 top
FLT  2.67,7.11 270 bottom
IC1  67.31,22.86 0 top
IC2  24.13,45.72 0 top
IC3  45.72,12.7 0 top
IC4  58.42,43.18 0 top
IC5  45.72,45.72 90 top
J1  -2.67,50.8 180 bottom
J2  124.46,44.45 0 bottom
J3  124.46,31.75 0 bottom
L1  51.69,42.93 180 top
L2  76.45,17.53 90 top
NTC+  16.51,38.1 90 top
NTC-  16.51,34.29 90 top
PGOOD  3.81,29.34 90 top
Q1  72.39,45.72 90 top
Q2  81.28,45.72 90 top
Q3  81.28,33.02 270 top
Q4  72.39,33.02 270 top
R1  62.23,20.32 90 top
R2  67.31,19.05 0 top
R3  11.02,16.1 90 top
R5  33.02,6.35 180 top
R6  62.23,24.13 270 top
R7  28.19,47.12 90 top
R8  28.19,43.69 90 top
R9  7.62,32.38 0 top
R10  20.19,43.56 90 top
R11  20.19,47.12 90 top
R12  60.33,47.24 90 top
R13  62.99,45.97 180 top
R14  58.67,47.24 270 top
R15  57.02,47.24 270 top
R16  62.99,44.32 180 top
R17  7.62,29.34 0 top
R18  6.35,7.11 0 bottom
R19  7.62,35.56 180 top
R21  44.83,20.32 0 top
R22  49.15,36.07 90 top
R23  49.15,39.5 90 top
R24  15.24,53.34 180 top
R25  20.32,53.34 180 top
R26  111.76,13.21 180 top
R27  111.76,15.24 180 top
R28  111.76,17.14 0 top
R29  111.76,11.18 0 top
R31  115.7,6.48 180 bottom
RST  20.32,19.05 0 top
STAT  119.38,6.48 90 bottom
SW  5.69,10.8 90 bottom
SWD  20.45,7.75 270 top
SWD_STLINK  60.96,6.35 90 bottom
U1  74.93,12.7 0 top
U2  62.23,35.56 180 bottom
USB  119.76,14.22 270 bottom

### Tracks (layer width: path | path; a pad name or v marks a point on that pad's centre or on a via)
+3V3  (via drill 0.35, 0.35 pad 0.13)
  Top 0.152: C14.1 49.93,4.68 49.53,5.08 49.53,6.9 IC3.32 49.47,9.84 v48.9,10.41 48.86,10.45 43.05,10.45 | C7.1 42.97,4.73 IC3.19 42.97,10.37 43.05,10.45 | C15.1 38.21,10.45 IC3.13 43.05,10.45 | SWD.1 19.81,9.38 19.58,9.61 19.58,10.69 21.21,12.32 28.32,12.32 29.21,11.43 29.21,7.62 v30.48,6.35 | 55.98,11.32 v55.88,11.43 | 69.91,11.32 C1.1 | R3.2 11.02,20.55 v11.05,20.57 | R9.2 R19.1
  Top 0.254: IC3.48 52.6,16.45 53.04,16.89 53.04,17.4 53.42,17.78 C6.1 54.24,18.68 v55.88,20.32 | IC5.8 43.82,53.07 C20.1 43.8,53.98 44.44,54.61 52.07,54.61 53.34,53.34 v53.34,48.26 | U1.1 71.12,11.32 | 71.12,11.32 71.12,17.78 71.72,18.38 L2.2 | v30.48,6.35 R5.2 | IC3.1 39.98,17.12 40.64,17.78 | 40.64,17.78 41.3,18.44 IC3.64 41.97,20.51 v42.04,20.57 44.32,22.86 v55.88,22.86 | R19.1 v11.05,35.56 | 40.64,17.78 39.99,18.43 C4.1 | 71.12,11.32 69.91,11.32 | C1.1 C3.1 67.94,11.39 | 55.92,11.39 v55.88,11.43 v55.88,3.81 69.85,3.81 71.12,5.08 71.12,11.32
  Bottom 0.152: v11.05,29.34 11.05,29.21
  Bottom 0.254: v30.48,6.35 35.43,6.35 37.34,4.45 42.93,4.45 v48.9,10.41 49.91,11.43 v55.88,11.43 v55.88,20.32 v55.88,22.86 | v11.05,35.56 11.05,29.21 v11.05,20.57 v42.04,20.57 53.34,31.88 v53.34,48.26 | SWD_STLINK.3 v55.88,3.81
+12V  (via drill 0.35)
  Top 0.152: IC1.9 72.89,23.36 v73.66,24.13 | R2.2 v71.12,19.05
  Top 0.254: IC2.1 IC2.2 21.85,46.22 21.84,46.23 | IC2.1 22.63,48.49 21.59,49.53 14.48,49.53 14.39,49.62 | 11.94,50.29 14.39,50.29 R24.2 | IC2.1 21.86,46.72 21.84,46.74
  Top 0.508: 71.98,43.18 Q1.2 72.66,43.31 | 72.39,40.26 72.52,40.13
  Top 1.016: 72.66,43.31 75.69,43.31 | Q1.2 72.39,40.26 | 13.97,46.99 13.96,47 J1.1 10.93,43.68 11.43,43.18
  Top 1.27: 71.98,43.18 v68.58,43.18
  Bottom 0.152: v67.31,44.45 v67.31,41.91 66.04,41.91 68.58,39.37 68.58,24.13 71.12,21.59 71.12,20.32 | v73.66,24.13 73.66,20.83 73.15,20.32 71.12,20.32 | 71.12,20.32 v71.12,19.05
  Bottom 0.508: 14.86,45.72 14.85,45.71
  Bottom 1.016: J1.1 10.93,44.21 10.92,44.2 | J1.1 10.94,46.99 13.97,46.99 | J1.1 10.93,49.79 v11.43,50.29
  other vias: 67.31,45.72 67.31,43.18 68.58,41.91 68.58,44.45 68.58,45.72 15.24,50.29 13.97,50.29 12.7,50.29
  pour Top: 76.2,39.75 76.2,46.74 66.67,46.74 66.67,39.75
  pour Bottom: 72.39,40.64 72.39,60.96 8.89,60.96 8.89,44.45 11.43,41.91 16.51,41.91 16.51,50.8 64.77,50.8 64.77,40.64
  pour Top: 8.89,40.64 8.89,50.8 22.99,50.8 22.99,46.1 21.59,46.1 21.59,48.9 16.51,48.9 16.51,40.64
ADC_CURRENT  (via drill 0.35)
  Top 0.152: IC5.7 45.09,46.35 v45.72,45.72 | v38.1,7.62 38.64,8.16 38.64,9.2 38.89,9.45 IC3.15 | v52.07,26.67 v45.72,26.67
  Bottom 0.152: v45.72,45.72 v45.72,26.67 | v38.1,7.62 39.37,6.35 40.13,6.35 52.07,18.29 v52.07,26.67
ADC_VBAT  (via drill 0.35)
  Top 0.152: IC3.14 38.78,9.95 36.83,8 v36.83,7.62 | v53.34,27.94 53.34,35.14 51.56,36.92 R22.2 R23.1
  Bottom 0.152: v36.83,7.62 38.86,5.59 41.28,5.59 53.34,17.65 v53.34,27.94
ADC_VIN  (via drill 0.35)
  Top 0.152: R24.1 R25.2 19.47,54.36 19.72,54.61 23.75,54.61 24.26,54.1 v24.26,50.16 | IC3.16 39.98,8.23 v39.37,7.62 | v50.8,25.4 30.48,25.4 28.32,27.56 v28.32,32.13
  Bottom 0.152: v39.37,7.62 40.01,7.62 50.8,18.41 v50.8,25.4 | v24.26,50.16 27.43,50.16 28.32,49.28 v28.32,32.13
GND  (via drill 0.35)  (1 unrouted)
  Top 0.152: SWD.5 20.32,5.65 20.32,3.81 | 25.63,43.18 25.63,42.14 25.4,41.91 | 58.67,42.93 IC4.17 | 57.91,38.62 C10.1 | IC5.5 49.31,48.43 51.04,50.16 C19.1
  Top 0.254: IC4.8 59.17,40.63 58.67,40.13
  Top 0.305: IC4.7 58.67,40.13 58.67,39.38 57.91,38.62 | IC4.7 IC4.8 | IC4.7 58.67,42.93 | 25.63,43.18 IC2.6 24.5,44.72 24.13,45.09 IC2.11
  Top 0.508: 116.66,35.38 116.84,35.56 | C18.1 C17.1 65.53,41.15 64.77,41.91 | C18.1 C11.1 61.98,41.73 | C18.1 63.75,42.56 C9.1 63.84,42.7 R16.1 R13.1 63.5,46.32 v63.5,48.26 | IC5.5 49.36,48.43 v49.53,48.26
  Top 1.016: IC2.11 24.13,41.91 | J3.2 116.66,43.18 | 116.66,43.18 J2.2 | 116.66,43.18 114.13,43.18 J2.3 | J3.3 116.57,30.75 116.84,30.48 | J3.2 119.37,35.55 119.38,35.56 | J3.2 116.84,35.37 116.84,31.75 | J2.2 120.65,48.26 | J2.2 116.84,48.43 116.84,52.07 | 7.62,55.88 7.93,55.57 J1.3 5.13,49 J1.2 | J1.2 1.27,46.99 | J1.2 5.08,46.95 5.08,43.18 | v1.4,50.29 v1.4,53.34
  Top 1.27: v3.68,50.29 3.68,53.21 v3.81,53.34 4.32,52.83 4.32,50.29 | v2.54,50.29 v2.54,53.34 | 2.54,50.8 v2.54,54.61
  Top 1.524: v63.5,49.53 63.5,50.8 | v50.8,48.26 50.8,52.07 | 51.94,48.26 51.63,47.94 52.7,46.86 53.84,46.86 55.12,48.14 55.12,52.96
  Bottom 0.254: USB.A12 USB.B1
  Bottom 0.508: 116.66,43.36 116.84,43.18 | 113.86,40.2 114.3,40.64 | 110.76,51.8 110.49,52.07
  Bottom 1.016: J1.2 5.13,49.48 5.08,49.53 | J1.2 5.08,46.95 5.08,44.45 | J1.2 2.54,46.99 | J1.3 7.92,51.82 4.95,51.82 | J2.3 117.84,43.45 118.11,43.18 | J2.3 113.84,43.43 110.49,43.43 | J2.3 113.86,40.2 | J2.3 113.86,46.55 114.3,46.99 | J2.2 116.84,48.07 116.84,45.72 | J2.2 120.64,48.25 120.65,48.26 | J2.2 116.84,48.43 116.84,52.07 | J2.2 113.93,48.25 113.92,48.26 | 116.84,39.37 116.66,39.19 J3.2 | J3.2 119.38,35.56 | J3.2 116.71,35.5 116.71,33.02 | J3.3 114.13,30.48 118.11,30.48 | J3.3 113.86,33.85 | J3.3 113.59,30.48 110.49,30.48 | J3.3 113.92,30.69 113.92,27.94 | J3.2 114.31,35.55 114.3,35.56
  Bottom 1.27: U2.2 23.34,41.12 v22.86,40.64 | U2.2 18.7,45.12 18.67,45.09 | U2.2 27.28,45.12 27.3,45.09 | U2.2 23.34,48.67 23.24,48.77
  other vias: 52.07,48.26 50.8,39.37 50.8,40.64 52.07,40.64 52.07,33.02 50.8,33.02 49.53,33.02 62.23,49.53 60.96,49.53 25.4,40.64 24.13,40.64 21.59,40.64 25.4,39.37 25.4,38.1 24.13,39.37 22.86,39.37 21.59,39.37 21.59,38.1 22.86,38.1 24.13,38.1
  pour Top: 7.62,50.8 7.62,39.5 17.78,39.5 17.78,48.26 20.32,48.26 20.32,43.18 27.94,43.18 27.94,40.64 48.26,40.64 48.26,49.53 66.04,49.53 66.04,39.75 61.85,39.75 61.85,43.18 59.31,43.18 59.31,29.84 100.97,29.84 104.14,26.67 114.3,26.67 114.3,54.61 106.68,54.61 102.87,50.8 43.43,50.8 42.16,52.07 -1.27,52.07 -1.27,60.96 124.46,60.96 124.46,-5.08 -2.54,-5.08 -3.81,-3.81 -3.81,48.26 -1.27,50.8
  pour Bottom: 7.62,59.69 7.62,44.45 11.43,40.64 17.78,40.64 17.78,49.53 27.94,49.53 27.94,33.02 26.67,31.75 16.51,31.75 16.51,20.32 41.91,20.32 41.91,49.53 63.5,49.53 63.5,39.37 73.66,39.37 73.66,59.69 125.73,59.69 125.73,-6.35 -3.81,-6.35 -3.81,59.69
LED1  (via drill 0.35)
  Top 0.152: IC3.2 38.66,15.95 v36.83,17.78
  Bottom 0.152: v36.83,17.78 21.21,17.78 10.54,7.11 R18.1
N$1
  Top 0.254: U1.6 73.22,14.07 72.81,14.48 C2.1
N$2
  Top 0.813: Q4.3 74.68,30.23 75.31,30.86 82.93,30.86 83.56,30.23 Q3.3
N$3  (via drill 0.35)
  Top 0.152: IC1.6 72.12,21.86 v72.39,21.59 | 79,27.68 Q3.1 79,26.93 v78.74,26.67 | Q4.1 70.12,26.93 v69.85,26.67
  Bottom 0.152: v78.74,26.67 v69.85,26.67 69.85,24.13 v72.39,21.59
N$4
  Bottom 0.152: R18.2 FLT.A
N$5  (via drill 0.35)
  Top 0.152: IC1.10 71.74,23.86 72.39,24.51 v72.39,25.4 | Q1.1 74.66,51.8 v74.93,52.07 | v83.82,52.07 83.56,51.8 Q2.1
  Bottom 0.152: v74.93,52.07 v83.82,52.07 83.82,29.21 80.01,25.4 v72.39,25.4
N$6
  Top 0.152: IC3.47 51.51,16 C12.1
N$7
  Top 0.152: IC1.1 64.15,23.86 63.03,24.98 R6.1
N$8
  Top 0.152: IC1.2 65.02,23.28 R6.2 R1.2 64.34,21.17 R2.1
N$9
  Top 0.152: 76.29,16.51 L2.1
  Top 0.254: U1.5 74.93,16.09 C2.2 76.29,16.51
N$10
  Top 0.813: Q2.3 79,48.51 78.36,47.88 70.74,47.88 70.11,48.51 Q1.3
N$11
  Top 0.152: IC4.12 60.17,43.93
  Top 0.254: 60.17,43.93 60.69,44.45 62.02,44.45 R16.2
N$12
  Top 0.152: IC3.31 48.97,5.27 C13.1
N$13  (via drill 0.35, 0.35 pad 0.13)
  Top 0.152: IC4.11 60.85,43.43 61.04,43.61 v60.96,43.69 | v12.19,19.18 12.19,25.4 10.41,27.18 8.89,27.18 8.47,27.6 R17.2
  Bottom 0.152: v60.96,43.69 60.96,37.85 42.29,19.18 v12.19,19.18
N$14
  Top 0.254: R10.2 21,45.22 IC2.4
N$15
  Top 0.152: R10.1 20.36,42.71 20.19,42.54 20.19,39.37 20.19,39.24 19.05,38.1 NTC+.TP
  Top 0.254: IC2.5 22.63,44.35 20.99,42.71 20.36,42.71
N$16
  Top 0.254: IC2.3 20.74,45.72 R11.1
N$17
  Top 0.152: 28.15,46.22 R7.1
  Top 0.254: IC2.9 28.15,46.22 | R7.1 R8.2
N$18
  Top 0.254: IC2.8 26.67,45.72 27.16,45.23 27.16,43.87 R8.1
N$19  (via drill 0.35)
  Top 0.152: IC2.7 25.75,45.1 26.12,45.1 26.67,44.55 v26.67,40.64 | CHRG.C 2.76,31.4 3.3,30.86 23.11,30.86 v26.67,34.42
  Bottom 0.152: v26.67,34.42 v26.67,40.64
N$20
  Top 0.152: C38.1 33.9,11.52 | 33.9,11.52 CLOCK.3 | IC3.6 36.85,13.95 36.83,13.97 36.34,13.97 33.9,11.52
N$21
  Top 0.152: 61.86,42.93 C9.2
  Top 0.254: IC4.10 61.86,42.93
N$22
  Top 0.254: IC4.16 57.02,45.33 R15.2
N$23
  Top 0.152: R14.2
  Top 0.254: IC4.14 R14.2
N$24
  Top 0.254: IC4.2 55.87,43.43 C8.1
N$25
  Top 0.152: 54.85,42.93 C8.2 55.12,42.43
  Top 0.254: 54.85,42.93 IC4.3 IC4.4 55.12,42.43
  Top 0.813: L1.1 52.9,42.81 C8.2
N$26
  Top 0.152: C39.1 32.22,16.43 CLOCK.1 32.99,13.03 32.99,13 33.3,12.7 34.34,12.7 34.65,13 34.65,13.06 36.04,14.45 IC3.5
N$27
  Top 0.152: R14.1 C5.2
N$28
  Top 0.152: 60.33,45.84 R12.1
  Top 0.254: IC4.13 60.33,45.84 60.46,45.97 R13.2
N$30
  Top 0.152: R19.2 3V3.A
N$31
  Bottom 0.152: STAT.A R31.2
N$32
  Top 0.254: USB.A4 115.1,16.35 114.81,16.64 114.81,17.78 112.52,20.07 D2.A 110.76,22.35 110.25,22.86 C21.2
  Bottom 0.152: USB.A4 USB.B9 117.72,16.35 118.11,15.96 118.11,12.57 117.64,12.1 USB.B4
  Bottom 0.254: USB.A9 USB.B4
N$33
  Top 0.152: R17.1 PGOOD.A
N$34
  Top 0.152: R9.1 CHRG.A
N$35
  Top 0.152: IC3.60 43.97,20.31
  Top 0.254: 43.97,20.31 R21.1
N$36  (via drill 0.35 pad 0.13)
  Top 0.152: R26.1 v114.55,13.21
  Bottom 0.152: USB.B6 116.83,13.8 115.98,14.65 USB.A6 114.85,14.65 114.55,14.36 v114.55,13.21
N$37  (via drill 0.35)
  Top 0.152: 58.17,40.63 C10.2 56.28,40.24 v55.88,40.64 | IC4.6 | IC4.15 58.17,45.05 57.8,45.42 57.8,46.99 57.67,47.12 56.14,47.12 v55.63,46.61
  Top 0.254: IC4.6 58.17,40.63
  Bottom 0.152: v55.63,46.61 55.63,40.89 v55.88,40.64
N$38
  Top 0.152: R27.1 114.3,15.24 USB.A7 115.99,13.8 116.84,14.65 USB.B7
N$40
  Top 0.152: C19.2 46.36,53.07 IC5.6
N$41
  Bottom 1.016: U2.4 101.12,25.88 101.6,25.4 101.6,25.52 U2.4
  Bottom 1.27: U2.3 U2.4
N$46
  Top 0.152: USB.B5 117.72,12.95 118.11,12.56 118.11,8.87 117.47,8.23 113.31,8.23 112.61,8.93 R29.2
N$47
  Top 0.152: 113.2,17.14 R28.2 113.33,17.14 114.98,15.5 USB.A5
RST  (via drill 0.35)
  Top 0.152: IC3.7 37.22,13.45 36.58,12.8 36.58,9.65 33.87,6.95 R5.1 33.87,3.81 | SWD.3 18.83,8.41 15.34,8.41 15.24,8.51 | 15.24,8.51 15.24,2.54 16.51,1.27 33.02,1.27 33.87,2.12 33.87,3.81 | 15.24,8.51 15.24,11.43 v13.97,12.7 | v13.97,15.24 C22.1 15.34,16.8 RST.3 RST.4 | v35.56,3.81 33.87,3.81
  Bottom 0.152: v13.97,12.7 v13.97,15.24 | SWD_STLINK.12 65.41,8.89 65.79,9.27 65.79,10.92 65.28,11.43 57.15,11.43 54.61,8.89 48.26,8.89 43.18,3.81 v35.56,3.81
STAT  (via drill 0.35)
  Top 0.152: IC3.27 46.99,6.94 v46.99,5.08
  Bottom 0.152: R31.1 113.16,6.48 107.44,0.76 51.31,0.76 v46.99,5.08
SW
  Top 0.152: IC3.4 37.12,14.95 35.56,16.51 35.56,17.78 34.29,19.05 30.48,19.05 25.4,13.97 11,13.97 | 11,13.97 C23.1 7.67,11.87 6.59,10.8 SW.1 | 11,13.97 11,15.23 R3.1
SWCLK  (via drill 0.35, 0.35 pad 0.13)
  Top 0.152: SWD.4 21.42,7.43 22.34,8.35 26.13,8.35 v26.67,8.89 | v43.18,13.97 43.05,13.97 42.29,14.73 42.29,15.62 42.93,16.26 48.77,16.26 49.47,16.96 IC3.49 49.47,20.26 50.8,21.59 v54.61,21.59 | v53.34,12.7 60.2,12.7 v66.17,6.73
  Bottom 0.152: v26.67,8.89 27.94,10.16 38.1,10.16 41.91,13.97 v43.18,13.97 | v66.17,6.73 66.17,5.46 65.79,5.08 SWD_STLINK.6 | v53.34,12.7 54.61,13.97 v54.61,21.59
SWDIO  (via drill 0.35, 0.35 pad 0.13)
  Top 0.152: SWD.2 21.43,9.05 21.43,10.61 22.34,11.53 23.63,11.53 23.73,11.43 v26.67,11.43 | v43.18,15.24 43.39,15.45 50.04,15.45 | 50.04,15.45 IC3.46 | 50.04,15.45 50.04,6.73 v52.96,3.81
  Bottom 0.152: v26.67,11.43 38.1,11.43 41.91,15.24 v43.18,15.24 | v52.96,3.81 55.12,1.65 65.41,1.65 66.04,2.29 66.04,3.3 65.53,3.81 SWD_STLINK.4
SWO  (via drill 0.35)
  Top 0.152: SWD.6 21.42,6.16 22.34,5.24 25.56,5.24 v26.67,6.35 | 43.22,12.7 v43.18,12.7 41.66,14.22 41.66,15.75 42.67,16.76 45.97,16.76 46.48,17.27 46.48,18.43 IC3.55
  Bottom 0.152: v26.67,6.35 29.21,8.89 38.1,8.89 41.91,12.7 v43.18,12.7
USB_DM  (via drill 0.35)
  Top 0.152: IC3.44 66.07,14.45 v67.31,13.21 | R27.2 v109.22,15.24
  Bottom 0.152: v67.31,13.21 67.31,13.97 68.58,15.24 v109.22,15.24
USB_DP  (via drill 0.35)
  Top 0.152: IC3.45 67.47,14.95 v69.22,13.21 | R26.2 v109.22,13.21
  Bottom 0.152: v109.22,13.21 v69.22,13.21
VBAT1  (via drill 0.35 pad 0.13)
  Top 0.152: R23.2 44.74,40.35 43.82,41.27 IC5.1
  Top 0.254: 25.63,47.35 26.24,47.97 26.67,47.97 | 26.4,46.72 26.54,46.86 | IC2.10 25.76,46.72 25.88,46.85 | 25.88,47.27 25.53,47.62
  Top 0.305: 25.63,47.35 IC2.10 26.4,46.72
  Top 0.356: 25.88,47.27 25.88,46.85
  Top 0.61: IC5.2 IC5.1 31.92,43.01 | R7.2 29.5,47.97 v30.48,46.99 v31.75,48.26 v39.37,48.26 | R7.2 26.67,47.97 | R7.2 28.19,49.53
  Bottom 1.27: U2.1 28.61,26.01 29.21,25.4 | U2.1 19.21,26.01 19.05,26.16 | U2.1 23.34,29.56 23.37,29.59 | U2.1 23.34,22.38 23.35,22.37
  other vias: 35.56,48.26 34.29,46.99 30.48,48.26 33.02,48.26 36.83,48.26 38.1,48.26 33.02,46.99 31.75,46.99 34.29,48.26 35.56,46.99 36.83,46.99 38.1,46.99 39.37,46.99
  pour Top: 25.27,46.61 25.27,50.8 41.4,50.8 41.4,44.45 45.34,44.45 45.34,41.91 29.46,41.91 29.46,47.37 26.67,47.37 26.67,46.61
  pour Bottom: 29.21,49.53 29.21,31.75 27.94,30.48 17.78,30.48 17.78,21.59 40.64,21.59 40.64,49.53
VBAT2
  Top 0.152: 55.82,45.78 55.88,45.72
  Top 0.305: C26.2 50.69,45.23
  Top 0.356: L1.2 50.59,45.13 50.69,45.23 | IC4.1 56.92,44.68 55.88,45.72 53.34,45.72 52.85,45.23 C26.2
  Top 0.61: IC5.3 IC5.4
  Top 0.813: 50.51,43.01 L1.2
  Top 1.016: IC5.4 50.51,43.01
VCC
  Top 0.152: IC1.8 80.01,22.86 86.36,29.21 105.41,29.21 | 74.93,8.25 74.3,7.62 C16.1
  Top 0.254: 74.93,8.25 U1.2 U1.3 78.42,11.32 79.06,10.69 103.95,10.69 107.17,13.91 107.17,19.56 D2.C
  Top 0.508: 107.08,43.58 107.95,44.45 | 85.96,35.16 86.36,35.56 | 81.28,44.45 | Q2.2 | 106.05,28.45 106.05,20.68 D2.C
  Top 1.016: J3.1 110.86,42.12 110.8,42.18 110.8,44.72 110.86,44.78 J2.1 | J2.1 107.96,48.25 107.95,48.26 | J3.1 107.96,35.55 107.95,35.56 | J2.1 110.86,51.7 110.74,51.82 | J3.1 110.86,33.26 106.05,28.45
  Top 1.27: Q2.2 107.08,43.58 | 85.96,35.16 Q3.2 81.28,44.45
  pour Top: 77.47,32 101.35,32 105.41,27.94 113.03,27.94 113.03,53.34 107.95,53.34 101.35,46.74 77.47,46.74
VO  (via drill 0.35)
  Top 0.152: v69.85,20.32 74.68,20.32 74.93,20.57 74.93,22.03 74.6,22.36 IC1.7 | R12.2 60.49,48.26 v62.23,48.26
  Top 0.305: IC4.9 60.69,42.43 60.96,42.16 | IC4.9 59.79,42.3 59.79,41.81 60.96,40.64 | 60.71,41.15 60.05,41.81 60.05,42.3 IC4.9
  Top 0.508: 68.98,35.16 68.58,35.56 | 75.71,35.16 75.82,35.05 | 67.31,38.1 66.92,38.49 C17.2 C18.2 C11.2 61.96,38.48 61.09,38.48
  Top 1.016: 75.71,35.16 Q4.2 72.39,38.48
  Top 1.27: Q4.2 68.98,35.16
  Bottom 0.152: v69.85,20.32 68.96,20.32 67.31,21.97 v67.31,34.29 62.23,39.37 v62.23,48.26
  pour Top: 61.09,38.99 76.2,38.99 76.2,32 59.94,32 59.94,42.54 61.09,42.54

### Text on the board
bNames: 12V, 3A out | 12V, 3A in | NTC
tStop: OpenSourceUPS | hacknus, 2024 | open source / hardware